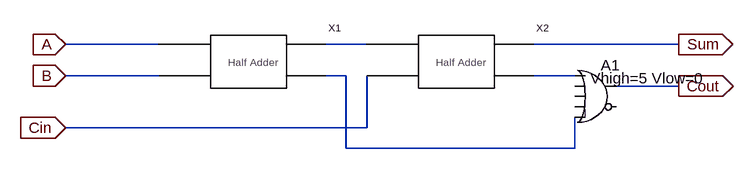
[diagram p0: schematic full_adder.asc]
full_adder.asc, the LTspice schematic file:
Version 4
SHEET 1 960 680
WIRE 48 96 -96 96
WIRE 368 96 304 96
WIRE 848 96 624 96
WIRE 48 144 -96 144
WIRE 336 144 304 144
WIRE 688 144 624 144
WIRE 848 160 752 160
WIRE 368 224 368 144
WIRE 368 224 -96 224
WIRE 336 256 336 144
WIRE 688 256 688 208
WIRE 688 256 336 256
FLAG -96 96 A
IOPIN -96 96 In
FLAG -96 144 B
IOPIN -96 144 In
FLAG -96 224 Cin
IOPIN -96 224 In
FLAG 848 96 Sum
IOPIN 848 96 Out
FLAG 848 160 Cout
IOPIN 848 160 Out
SYMBOL half_adder 192 128 R0
SYMATTR InstName X1
SYMBOL half_adder 512 128 R0
SYMATTR InstName X2
SYMBOL Digital\\or 720 112 R0
WINDOW 3 -8 36 Left 2
SYMATTR InstName A1
SYMATTR Value Vhigh=5 Vlow=0

The netlist it stands for:
* full_adder.asc
XX1 A B N001 N002 half_adder  ; pins A B Sum carry
XX2 N001 Cin Sum N003 half_adder  ; pins A B Sum carry
A1 N003 0 0 0 N002 0 Cout 0 OR Vhigh=5 Vlow=0
.backanno
.end